# EAGLE design gamby-prototype1 (EAGLE 5.10)
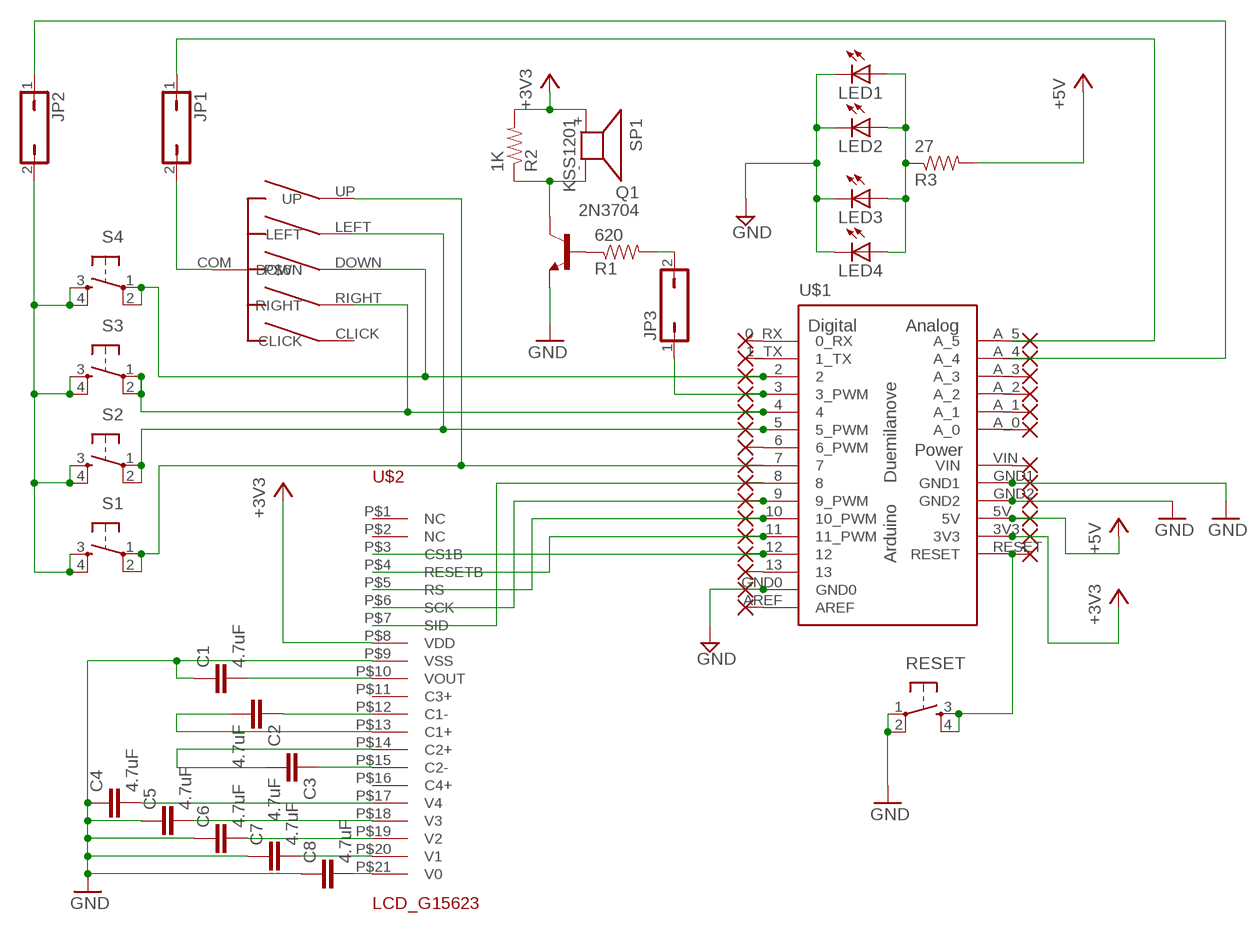
[diagram p0: schematic, sheet 1]

## Parts
C1  4.7uF  C2.5/2  [C2.5-2]
C2  4.7uF  C2.5/2  [C2.5-2]
C3  4.7uF  C2.5/2  [C2.5-2]
C4  4.7uF  C2.5/2  [C2.5-2]
C5  4.7uF  C2.5/2  [C2.5-2]
C6  4.7uF  C2.5/2  [C2.5-2]
C7  4.7uF  C2.5/2  [C2.5-2]
C8  4.7uF  C2.5/2  [C2.5-2]
JP1  JP1Q  [JP1]
JP2  JP1Q  [JP1]
JP3  JP1Q  [JP1]
LED1  LEDSMT1206  [1206]
LED2  LEDSMT1206  [1206]
LED3  LEDSMT1206  [1206]
LED4  LEDSMT1206  [1206]
PAD1  1,6/0,8  [1,6/0,8]
PAD2  1,6/0,8  [1,6/0,8]
PAD3  1,6/0,8  [1,6/0,8]
PAD4  1,6/0,8  [1,6/0,8]
PAD5  1,6/0,8  [1,6/0,8]
PAD6  1,6/0,8  [1,6/0,8]
PAD7  1,6/0,8  [1,6/0,8]
PAD8  1,6/0,8  [1,6/0,8]
PAD9  1,6/0,8  [1,6/0,8]
PAD10  1,6/0,8  [1,6/0,8]
PAD11  1,6/0,8  [1,6/0,8]
PAD12  1,6/0,8  [1,6/0,8]
PAD13  1,6/0,8  [1,6/0,8]
PAD14  1,6/0,8  [1,6/0,8]
PAD15  1,6/0,8  [1,6/0,8]
PAD16  1,6/0,8  [1,6/0,8]
PAD17  1,6/0,8  [1,6/0,8]
PAD19  1,6/0,8  [1,6/0,8]
PAD20  1,6/0,8  [1,6/0,8]
PAD21  1,6/0,8  [1,6/0,8]
PAD22  1,6/0,8  [1,6/0,8]
PAD23  1,6/0,8  [1,6/0,8]
PAD24  1,6/0,8  [1,6/0,8]
PAD25  1,6/0,8  [1,6/0,8]
PAD26  1,6/0,8  [1,6/0,8]
PAD27  1,6/0,8  [1,6/0,8]
PAD28  1,6/0,8  [1,6/0,8]
PAD29  1,6/0,8  [1,6/0,8]
Q1  2N3704  [TO92]
R1  620  RESISTORPTH1  [AXIAL-0.3]
R2  1K  RESISTORPTH1  [AXIAL-0.3]
R3  27  RESISTORPTH1  [AXIAL-0.3]
RESET  TAC_SWITCHPTH  [TACTILE-PTH]
S1  TAC_SWITCHPTH  [TACTILE-PTH]
S2  TAC_SWITCHPTH  [TACTILE-PTH]
S3  TAC_SWITCHPTH  [TACTILE-PTH]
S4  TAC_SWITCHPTH  [TACTILE-PTH]
SP1  KSS1201  [KSS1201]
U$1  ARDUINO-USBLONG_PADS_TEXT  [SHIELD]
U$2  LCD_G15623  [LCD_G15623]
U$3  DEV1  [DIP]

## Nets
+3V3: PAD27.1(P) R2.P$2 SP1.+ U$1.3V3 U$2.P$8(VDD)
+5V: PAD26.1(P) R3.P$2 U$1.5V
BUTTON_A: PAD15.1(P) S1.1 S1.2 U$1.7 U$3.UP
GND: C1.1 C4.1 C5.1 C6.1 C7.1 C8.1 LED1.C LED2.C LED3.C LED4.C PAD22.1(P) PAD24.1(P) Q1.3(E) RESET.1 RESET.2 U$1.GND0 U$1.GND1 U$2.P$9(VSS)
GND2: PAD25.1(P) U$1.GND2 ; supply symbol labelled GND
N$1: PAD16.1(P) U$1.8 U$2.P$7(SID)
N$2: PAD29.1(P) U$1.9(9_PWM) U$2.P$6(SCK)
N$3: PAD19.1(P) U$1.10(10_PWM) U$2.P$5(RS)
N$4: PAD20.1(P) U$1.11(11_PWM) U$2.P$4(RESETB)
N$5: PAD17.1(P) U$1.12 U$2.P$3(CS1B)
N$6: JP1.2 U$3.COM
N$7: PAD13.1(P) S3.1 S3.2 U$1.4 U$3.RIGHT
N$9: PAD9.1(P) U$1.6(6_PWM)
N$13: PAD23.1(P) U$1.VIN
N$15: Q1.2(C) R2.P$1 SP1.-
N$17: Q1.1(B) R1.P$1
N$18: JP3.1 PAD12.1(P) U$1.3(3_PWM)
N$20: JP3.2 R1.P$2
N$21: C7.2 U$2.P$20(V1)
N$22: C5.2 U$2.P$18(V3)
N$23: C8.2 U$2.P$21(V0)
N$24: C4.2 U$2.P$17(V4)
N$25: PAD21.1(P) U$1.13
N$26: C6.2 U$2.P$19(V2)
N$28: PAD1.1(P) U$1.A_0
N$29: C3.1 U$2.P$15(C2-)
N$30: C3.2 U$2.P$14(C2+)
N$32: C2.2 U$2.P$13(C1+)
N$33: C2.1 U$2.P$12(C1-)
N$35: PAD2.1(P) U$1.A_1
N$36: C1.2 U$2.P$10(VOUT)
N$37: LED1.A LED2.A LED3.A LED4.A R3.P$1
N$38: JP1.1 PAD6.1(P) U$1.A_5
N$39: PAD11.1(P) S4.1 S4.2 U$1.2 U$3.DOWN
N$40: PAD14.1(P) S2.1 S2.2 U$1.5(5_PWM) U$3.LEFT
N$41: JP2.1 PAD5.1(P) U$1.A_4
N$42: PAD28.1(P) RESET.3 RESET.4 U$1.RESET
N$43: PAD3.1(P) U$1.A_2
N$44: PAD4.1(P) U$1.A_3
N$45: JP2.2 S1.3 S1.4 S2.3 S2.4 S3.3 S3.4 S4.3 S4.4
N$46: PAD7.1(P) U$1.0_RX
N$47: PAD8.1(P) U$1.1_TX
N$49: PAD10.1(P) U$1.AREF
Unconnected: U$2.P$1(NC) U$2.P$2(NC) U$2.P$11(C3+) U$2.P$16(C4+) U$3.CLICK

## Library data of the parts
C1-C8 = capacitor-wima:C: CAPACITOR naming: grid - package width
JP1-JP3 = jumper:JP1Q: JUMPER
LED1-LED4 = led:LED: LED OSRAM: - CHIPLED LG R971, LG N971, LY N971, LG Q971, LY Q971, LO R971, LY R971 LH N974, LH R974 LS Q976, LO Q976, LY Q976 LO Q996 - Hyper CHIPLED LW Q18S LB Q993, LB Q99A, LB R99A - SideLED LS A670, LO A670, LY A670, LG A670, LP A670 LB A673, LV A673, LT A673, LW A673 LH A674 LY A675 LS A676, LA A676, LO A676, LY A676, LW A676 LS A679, LY A679, LG A679 - Hyper Micro SIDELED® LS Y876, LA Y876, LO Y876, LY Y876 LT Y87S - SmartLED LW L88C, LW L88S LB L89C, LB L89S, LG L890 LS L89K, LO L89K, LY L89K LS L896, LA L896, LO L896, LY L896 - TOPLED LS T670, LO T670, LY T670, LG T670, LP T670 LSG T670, LSP T670, LSY T670, LOP T670, LYG T670 LG T671, LOG T671, LSG T671 LB T673, LV T673, LT T673, LW T673 LH T674 LS T676, LA T676, LO T676, LY T676, LB T676, LH T676, LSB T676, LW T676 LB T67C, LV T67C, LT T67C, LS T67K, LO T67K, LY T67K, LW E67C LS E67B, LA E67B, LO E67B, LY E67B, LB E67C, LV E67C, LT E67C LW T67C LS T679, LY T679, LG T679 LS T770, LO T770, LY T770, LG T770, LP T770 LB T773, LV T773, LT T773, LW T773 LH T774 LS E675, LA E675, LY E675, LS T675 LS T776, LA T776, LO T776, LY T776, LB T776 LHGB T686 LT T68C, LB T68C - Hyper Mini TOPLED® LB M676 - Mini TOPLED Santana® LG M470 LS M47K, LO M47K, LY M47K Source: http://www.osram.convergy.de LUXEON: - LUMILED® LXK2-PW12-R00, LXK2-PW12-S00, LXK2-PW14-U00, LXK2-PW14-V00 LXK2-PM12-R00, LXK2-PM12-S00, LXK2-PM14-U00 LXK2-PE12-Q00, LXK2-PE12-R00, LXK2-PE12-S00, LXK2-PE14-T00, LXK2-PE14-U00 LXK2-PB12-K00, LXK2-PB12-L00, LXK2-PB12-M00, LXK2-PB14-N00, LXK2-PB14-P00, LXK2-PB14-Q00 LXK2-PR12-L00, LXK2-PR12-M00, LXK2-PR14-Q00, LXK2-PR14-R00 LXK2-PD12-Q00, LXK2-PD12-R00, LXK2-PD12-S00 LXK2-PH12-R00, LXK2-PH12-S00 LXK2-PL12-P00, LXK2-PL12-Q00, LXK2-PL12-R00 Source: www.luxeon.com KINGBRIGHT: KA-3528ASYC Source: www.kingbright.com
PAD1-PAD17 PAD19-PAD29 = wirepad:1,6/0,8: THROUGH-HOLE PAD
Q1 = transistor:2N3704: NPN TRANSISTOR
R1-R3 = SparkFun:RESISTOR: Resistor Basic schematic elements and footprints for 0603, 1206, and PTH 1/10th watt (small) resistors.
RESET S1-S4 = SparkFun:TAC_SWITCH: Momentary Switch Button commonly used for reset or general input. Spark Fun Electronics SKU : COM-00097
SP1 = buzzer:KSS1201: SPEAKER Source: Schukat
U$1 = Arduino-Various:ARDUINO-USB: The Ardiuno Duemilanove Pinouts layoutet as a Bare Shield. v0.5 Also for Arduino Diecimila. This is designed as a Part and has no Outline in the Dimension Layer. The Outline, when present, is drawed at the tPlace / bPlace Layer. Library by Stephanie Lange, http://www.k-ita.de/~sl/
U$2 = goldlcd:LCD_G15623
U$3 = alps-5wayswitch:DEV1

## Board
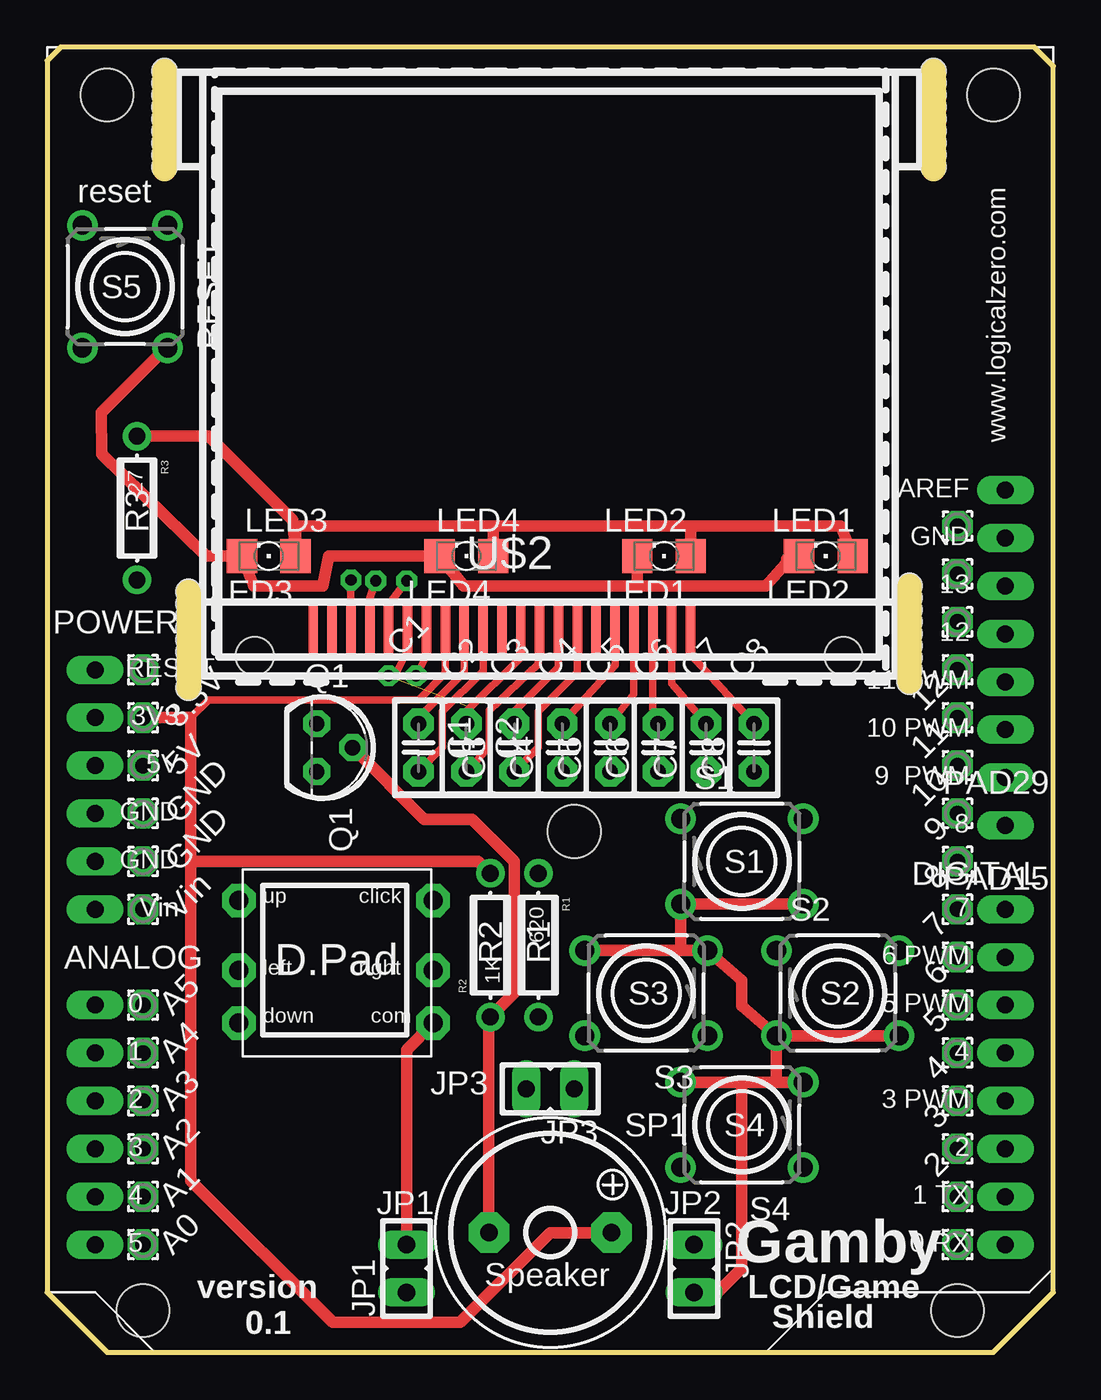
[diagram p1: board, top side]
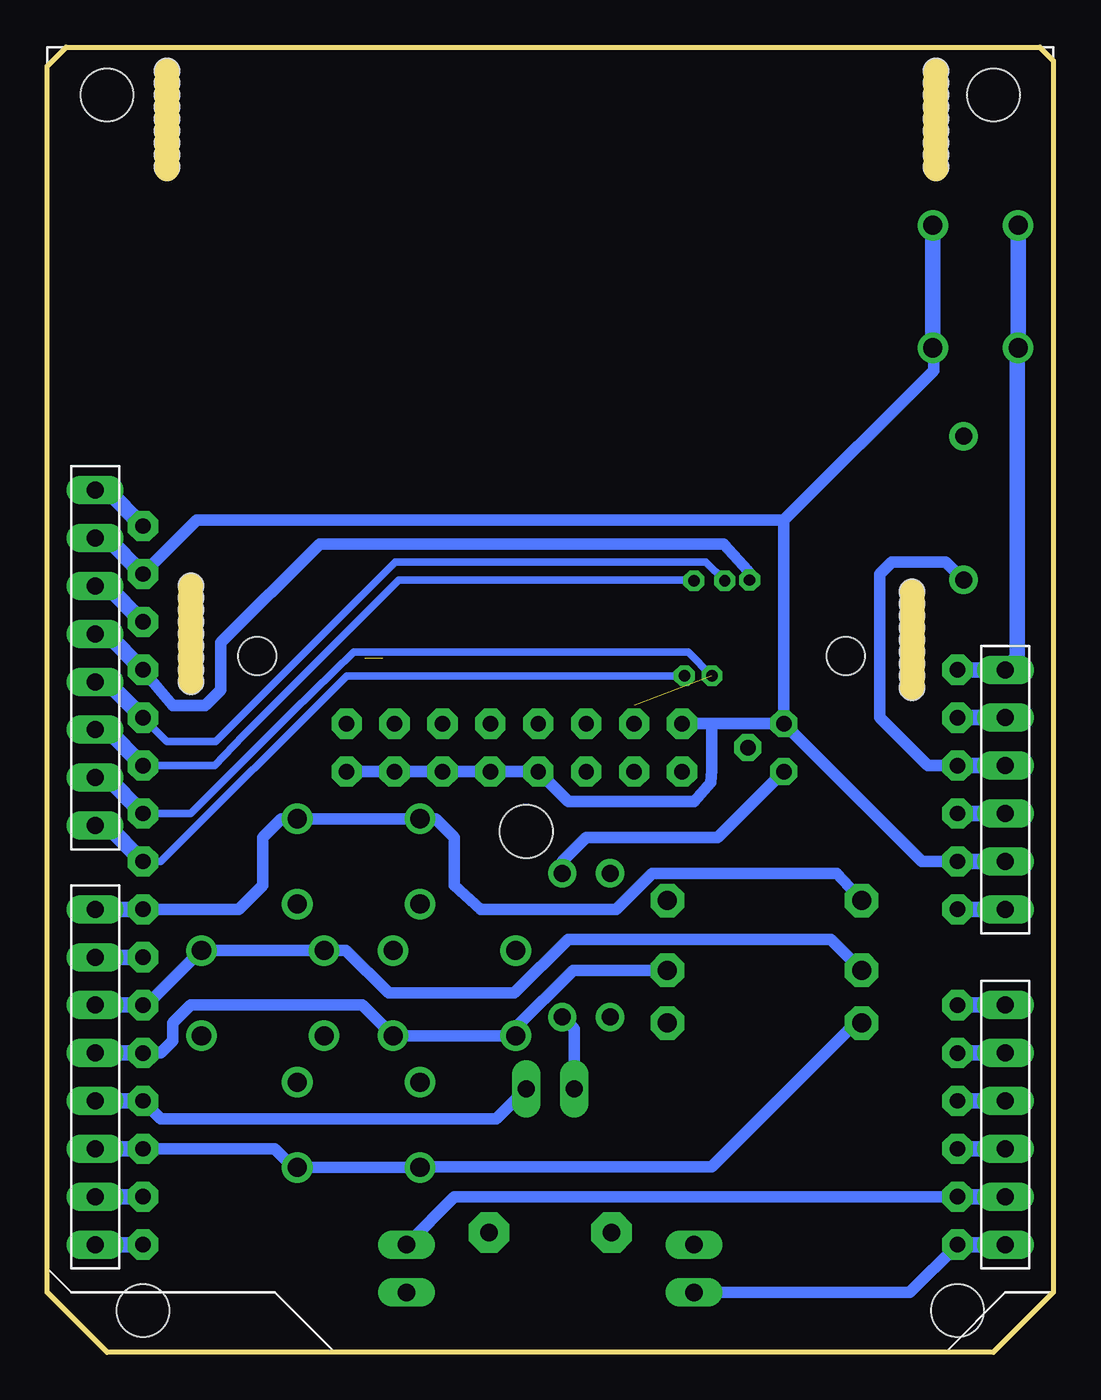
[diagram p2: board, bottom side, seen from below]

Size 53.34 x 69.22 mm. Coordinates in mm from the lower left corner, seen from the top.
Outline: 0,3.17 3.17,0 50.16,0 53.34,3.17 53.34,68.21 52.34,69.22 0.71,69.22 0,68.51 0,3.17
Copper layers (1*16): Top 0.035mm / dielectric 1.5mm / Bottom 0.035mm
Design rules "SparkFun": minimum track width 8mil, minimum drill 20mil, track to track 8mil, track to pad 8mil, pad to pad 8mil, via to via 8mil, smd to smd 8mil, copper to edge 10mil, drill to drill 8mil, minimum pad ring 12mil, minimum via ring 10mil, stop-mask expansion 4mil, vias tented up to drill 25mil, thermal gap 10mil
Holes 2.8 mm at 3.17,66.68 50.16,66.68 5.08,2.22 48.26,2.22 27.94,27.62
Holes 1.3 mm at 7.49,40.32 7.49,39.69 7.49,39.05 7.49,38.42 7.49,37.78 7.49,35.24 7.49,35.88 7.49,36.51 7.49,37.15 45.72,40.64 45.72,40 45.72,39.37 45.72,38.73 45.72,38.1 45.72,35.56 45.72,36.2 45.72,36.83 45.72,37.46 46.99,67.95 46.99,67.31 46.99,66.68 46.99,66.04 46.99,65.41 46.99,62.86 46.99,63.5 46.99,64.14 46.99,64.77 6.22,67.95 6.22,67.31 6.22,66.68 6.22,66.04 6.22,65.41 6.22,62.86 6.22,63.5 6.22,64.14 6.22,64.77
Milling: 4 lines

### Footprints (pad centres in the part's own frame; a part is rotated, then mirrored left to right if it is on the bottom)
C2.5-2 = drill 0.813 pad 1.6 octagon: 1 -1.27,0; 2 1.27,0
JP1 = drill 0.914 long: 1 0,-1.27; 2 0,1.27
1206 = smd 1.6 x 1.803: A -1.422,0; C 1.422,0
1,6/0,8 = drill 0.813 pad 1.6 octagon: 1 0,0
TO92 = drill 0.813 octagon: 1 1.27,0; 2 0,1.905; 3 -1.27,0
AXIAL-0.3 = drill 0.9 round: P$1 -3.81,0; P$2 3.81,0
TACTILE-PTH = drill 1.016 round: 1 -3.251,2.261; 2 3.251,2.261; 3 -3.251,-2.261; 4 3.251,-2.261
KSS1201 = drill 0.914 pad 2.159 octagon: + 3.251,0; - -3.251,0
SHIELD = drill 0.9 pad 1.27 long: 0_RX -25.4,27.94; 1_TX -25.4,25.4; 2 -25.4,22.86; 3 -25.4,20.32; 3V3 22.86,0; 4 -25.4,17.78; 5 -25.4,15.24; 5V 22.86,2.54; 6 -25.4,12.7; 7 -25.4,10.16; 8 -25.4,5.715; 9 -25.4,3.175; 10 -25.4,0.635; 11 -25.4,-1.905; 12 -25.4,-4.445; 13 -25.4,-6.985; A_0 22.86,15.24; A_1 22.86,17.78; A_2 22.86,20.32; A_3 22.86,22.86; A_4 22.86,25.4; A_5 22.86,27.94; AREF -25.4,-12.065; GND0 -25.4,-9.525; GND1 22.86,7.62; GND2 22.86,5.08; RESET 22.86,-2.54; VIN 22.86,10.16
LCD_G15623 = smd 0.5 x 3: P$1 5.85,2.5; P$2 6.85,2.5; P$3 7.85,2.5; P$4 8.85,2.5; P$5 9.85,2.5; P$6 10.85,2.5; P$7 11.85,2.5; P$8 12.85,2.5; P$9 13.85,2.5; P$10 14.85,2.5; P$11 15.85,2.5; P$12 16.85,2.5; P$13 17.85,2.5; P$14 18.85,2.5; P$15 19.85,2.5; P$16 20.85,2.5; P$17 21.85,2.5; P$18 22.85,2.5; P$19 23.85,2.5; P$20 24.85,2.5; P$21 25.85,2.5 | hole 2: 2.75,1.05; 33.95,1.05
DIP = drill 1 pad 1.778 octagon: CLICK 10.3,6.5; COM 10.3,0; DOWN 0,0; LEFT 0,2.8; RIGHT 10.3,2.8; UP 0,6.5

### Placement (x,y rotation side)
C1  19.68,32.07 270 top
C2  22.23,32.07 270 top
C3  24.77,32.07 90 top
C4  27.3,32.07 90 top
C5  29.84,32.07 90 top
C6  32.38,32.07 90 top
C7  34.92,32.07 90 top
C8  37.47,32.07 90 top
JP1  19.05,4.45 0 top
JP2  34.29,4.45 180 top
JP3  26.67,13.97 90 top
LED1  32.7,42.23 180 top
LED2  41.27,42.23 180 top
LED3  11.75,42.23 180 top
LED4  22.23,42.23 180 top
PAD1  5.08,18.42 0 top
PAD2  5.08,15.88 0 top
PAD3  5.08,13.33 0 top
PAD4  5.08,10.79 0 top
PAD5  5.08,8.26 0 top
PAD6  5.08,5.71 0 top
PAD7  48.26,5.71 0 top
PAD8  48.26,8.26 0 top
PAD9  48.26,20.96 0 top
PAD10  48.26,43.81 0 top
PAD11  48.26,10.79 0 top
PAD12  48.26,13.33 0 top
PAD13  48.26,15.88 0 top
PAD14  48.26,18.42 0 top
PAD15  48.26,23.5 0 top
PAD16  48.26,26.04 0 top
PAD17  48.26,36.2 0 top
PAD19  48.26,31.12 0 top
PAD20  48.26,33.66 0 top
PAD21  48.26,38.73 0 top
PAD22  48.26,41.27 0 top
PAD23  5.08,23.5 0 top
PAD24  5.08,26.04 0 top
PAD25  5.08,28.58 0 top
PAD26  5.08,31.12 0 top
PAD27  5.08,33.66 0 top
PAD28  5.08,36.2 0 top
PAD29  48.26,28.58 0 top
Q1  14.29,32.07 270 top
R1  26.04,21.59 270 top
R2  23.5,21.59 90 top
R3  4.76,44.77 270 top
RESET  4.13,56.52 270 top
S1  36.83,26.04 0 top
S2  41.91,19.05 0 top
S3  31.75,19.05 180 top
S4  36.83,12.06 180 top
SP1  26.67,6.35 0 top
U$1  25.4,33.66 180 top
U$2  8.26,35.88 0 top
U$3  10.16,17.46 0 top

### Tracks (layer width: path | path; a pad name or v marks a point on that pad's centre or on a via)
+3V3
  Top 0.406: 7.62,33.66 8.57,34.61 19.68,34.61 21.11,36.03 U$2.P$8
  Top 0.61: PAD27.1 7.62,33.66 7.62,26.04 | SP1.+ 26.67,6.35 21.91,1.59 15.13,1.59 7.62,9.1 7.62,26.04 | 7.62,26.04 22.86,26.04 R2.P$2
  Bottom 0.813: PAD27.1 U$1.3V3
+5V
  Bottom 0.61: R3.P$2 5.71,41.91 8.57,41.91 9.21,41.27 9.21,33.66 6.67,31.12 PAD26.1
  Bottom 0.813: U$1.5V PAD26.1
BUTTON_A
  Bottom 0.61: U$3.UP 11.49,25.4 21.27,25.4 23.18,23.5 30.37,23.5 31.75,24.77 31.75,27.31 32.74,28.3 S1.1 S1.2 40.92,28.3 41.91,27.31 41.91,24.77 43.18,23.5 PAD15.1
  Bottom 0.813: PAD15.1 U$1.7
GND
  Top 0.406: C1.1 19.68,33.66 22.11,36.07 U$2.P$9 | 39.22,42.08 LED2.C
  Top 0.61: 39.22,42.08 39.37,42.08 38.1,40.64 31.28,40.64 | 31.28,40.64 LED1.C | 31.28,40.64 22.07,40.64 LED4.C 14.92,42.23 14.61,40.64 10.96,40.64 LED3.C 8.42,42.23 2.9,47.62 2.86,49.85 6.27,53.26 RESET.2
  Bottom 0.406: 6.39,53.98 6.35,53.94 | C1.1 19.68,33.6
  Bottom 0.61: RESET.2 6.35,53.26 6.35,52.07 14.29,44.13 | Q1.3 14.29,44.13 | C8.1 C7.1 C6.1 C5.1 C4.1 25.72,29.21 19.05,29.21 18.15,30.22 18.1,30.85 18.1,33.34 | Q1.3 18.1,33.34 | PAD24.1 6.99,26.04 Q1.3 | PAD22.1 45.4,44.13 14.29,44.13 | 18.1,33.34 C1.1
  Bottom 0.813: RESET.2 6.39,53.98 RESET.1 | PAD22.1 50.16,43.18 U$1.GND0 | U$1.GND1 PAD24.1
GND2
  Bottom 0.813: U$1.GND2 PAD25.1
N$1  (via drill 0.6)  (1 unrouted)
  Top 0.406: v19.56,35.88 20.11,36.93 U$2.P$7
  Bottom 0.406: PAD16.1 47.31,26.04 37.47,35.88 v19.56,35.88
  Bottom 0.813: PAD16.1 50.16,27.94 U$1.8
N$2  (via drill 0.6)  (1 unrouted)
  Top 0.406: v18.1,35.88 18.41,35.88 19.05,37.15 19.05,39.59 U$2.P$6
  Bottom 0.406: PAD29.1 45.72,28.58 40.32,33.97 37.08,37.15 19.37,37.15 v18.1,35.88
  Bottom 0.813: U$1.9 50.16,30.48 PAD29.1
N$3  (via drill 0.6)
  Top 0.406: v19.06,40.92 18.11,39.65 U$2.P$5
  Bottom 0.406: PAD19.1 44.45,31.12 42.95,32.7 34.7,40.96 19.06,40.96 v19.06,40.92
  Bottom 0.813: U$1.10 50.16,33.02 PAD19.1
N$4  (via drill 0.6)
  Top 0.406: v17.42,40.92 17.11,39.96 U$2.P$4
  Bottom 0.406: PAD20.1 46.99,32.38 44.4,32.38 34.88,41.91 18.41,41.91 v17.42,40.92
  Bottom 0.813: U$1.11 50.16,35.56 PAD20.1
N$5  (via drill 0.6)
  Top 0.406: v16.11,40.96 U$2.P$3
  Bottom 0.61: PAD17.1 46.67,34.29 44.96,34.29 44.13,35.12 44.13,37.63 38.9,42.86 17.46,42.86 16.19,41.46 v16.11,40.96
  Bottom 0.813: PAD17.1 50.16,38.1 U$1.12
N$6
  Top 0.61: JP1.2 19.05,16.05 U$3.COM
N$7
  Bottom 0.61: PAD13.1 47.31,15.88 46.67,16.51 46.67,17.46 45.72,18.42 36.63,18.42 S3.1 S3.2 28.57,16.87 28.57,17.15 25.46,20.26 U$3.RIGHT
  Bottom 0.813: PAD13.1 U$1.4
N$9
  Bottom 0.813: PAD9.1 U$1.6
N$13
  Bottom 0.813: U$1.VIN PAD23.1
N$15
  Top 0.406: 23.42,17.78 R2.P$1
  Top 0.61: SP1.- 23.42,17.78 | Q1.2 20,28.26 22.54,28.26 24.77,26.04 24.77,19.05 R2.P$1
N$17
  Bottom 0.61: R1.P$1 26.04,26.04 24.77,27.31 17.78,27.31 Q1.1
N$18
  Bottom 0.61: JP3.1 29.53,12.38 47.31,12.38 PAD12.1
  Bottom 0.813: PAD12.1 U$1.3
N$20
  Bottom 0.61: JP3.2 25.4,17.15 R1.P$2
N$21
  Top 0.406: C7.2 33.1,35.48 U$2.P$20
N$22
  Top 0.406: C5.2 31.11,34.91 U$2.P$18
N$23
  Top 0.406: C8.2 34.1,37.02 U$2.P$21
N$24
  Top 0.406: C4.2 30.11,36.45 U$2.P$17
N$25
  Bottom 0.813: PAD21.1 50.16,40.64 U$1.13
N$26
  Top 0.406: C6.2 32.1,34.01 U$2.P$19
N$28
  Bottom 0.813: U$1.A_0 PAD1.1
N$29
  Top 0.406: C3.1 26.04,32.07 26.04,33.97 28.11,36.04 U$2.P$15
N$30
  Top 0.406: C3.2 24.77,33.97 27.11,36.31 U$2.P$14
N$32
  Top 0.406: C2.2 22.54,31.12 23.44,32.14 23.44,34.04 26.04,36.51 U$2.P$13
N$33
  Top 0.406: C2.1 22.23,33.97 25.11,36.85 U$2.P$12
N$35
  Bottom 0.813: U$1.A_1 PAD2.1
N$36
  Top 0.406: C1.2 20.95,32.07 20.95,33.97 23.11,36.12 U$2.P$10
N$37
  Top 0.406: LED3.A 13.17,42.06 | LED4.A 23.81,42.23
  Top 0.61: LED2.A 42.06,43.81 34.12,43.81 | 23.65,43.81 LED4.A | 34.12,43.81 LED1.A | 23.65,43.81 34.12,43.81 | 23.65,43.81 13.17,43.81 LED3.A 13.02,44.13 8.57,48.58 R3.P$1
N$38
  Bottom 0.61: PAD6.1 7.62,3.17 JP1.1
  Bottom 0.813: U$1.A_5 PAD6.1
N$39
  Bottom 0.61: PAD11.1 41.27,10.79 40.28,9.8 S4.1 S4.2 33.54,9.84 18.1,9.84 10.48,17.46 U$3.DOWN
  Bottom 0.813: PAD11.1 U$1.2
N$40
  Bottom 0.61: PAD14.1 48.06,18.42 S2.2 S2.1 37.5,21.31 35.24,19.05 28.57,19.05 25.72,21.91 11.8,21.91 U$3.LEFT
  Bottom 0.813: PAD14.1 U$1.5
N$41
  Bottom 0.61: PAD5.1 31.75,8.26 JP2.1
  Bottom 0.813: U$1.A_4 PAD5.1
N$42
  Bottom 0.813: RESET.3 RESET.4 1.91,52.91 1.91,36.83 U$1.RESET PAD28.1
N$43
  Bottom 0.813: U$1.A_2 PAD3.1
N$44
  Bottom 0.813: U$1.A_3 PAD4.1
N$45
  Top 0.61: S1.4 S1.3 33.58,21.31 S3.3 | S2.3 S2.4 | S3.3 35.2,21.31 | 36.83,14.33 S4.4 | 36.83,14.33 S4.3 38.66,14.33 S2.3 | S3.3 S3.4 | S2.3 36.83,18.38 36.83,19.72 S3.3 | JP2.2 35.56,3.17 36.83,4.45 36.83,14.33
N$46
  Bottom 0.813: PAD7.1 U$1.0_RX
N$47
  Bottom 0.813: PAD8.1 U$1.1_TX
N$49
  Bottom 0.813: U$1.AREF 50.16,45.72 PAD10.1

### Text on the board
_tsilk: reset | S5 | www.logicalzero.com | R3 | LED3 | LED4 | LED2 | LED1 | C1 | 12 | Q1 | C2 | C3 | C4 | C5 | C6 | C7 | C8 | 11 | 3.3V | 5V | 10 | 9 | GND | GND | S1 | 8 | 7 | Vin | R2 | R1 | 6 | D.Pad | S3 | S2 | 5 | A5 | A4 | 4 | JP3 | 3 | A3 | S4 | A2 | 2 | A1 | JP1 | JP2 | A0 | Gamby | Speaker | version | LCD/Game | Shield | 0.1